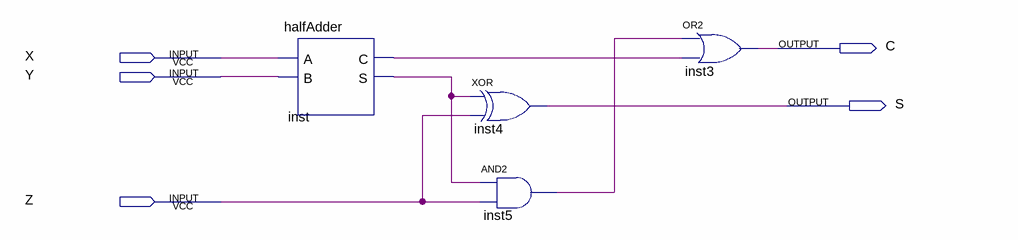
[diagram p0: schematic sheet]
// Quartus schematic fullAdder.bdf as structural Verilog: 4 symbols, 5 pins
module fullAdder (
  input  X,
  input  Y,
  input  Z,
  output C,
  output S
);

  wire inst5_out, inst_c, inst_s;

  halfAdder inst (.A(X), .B(Y), .C(inst_c), .S(inst_s));
  xor inst4 (S, inst_s, Z);
  and inst5 (inst5_out, inst_s, Z);
  or inst3 (C, inst5_out, inst_c);
endmodule
